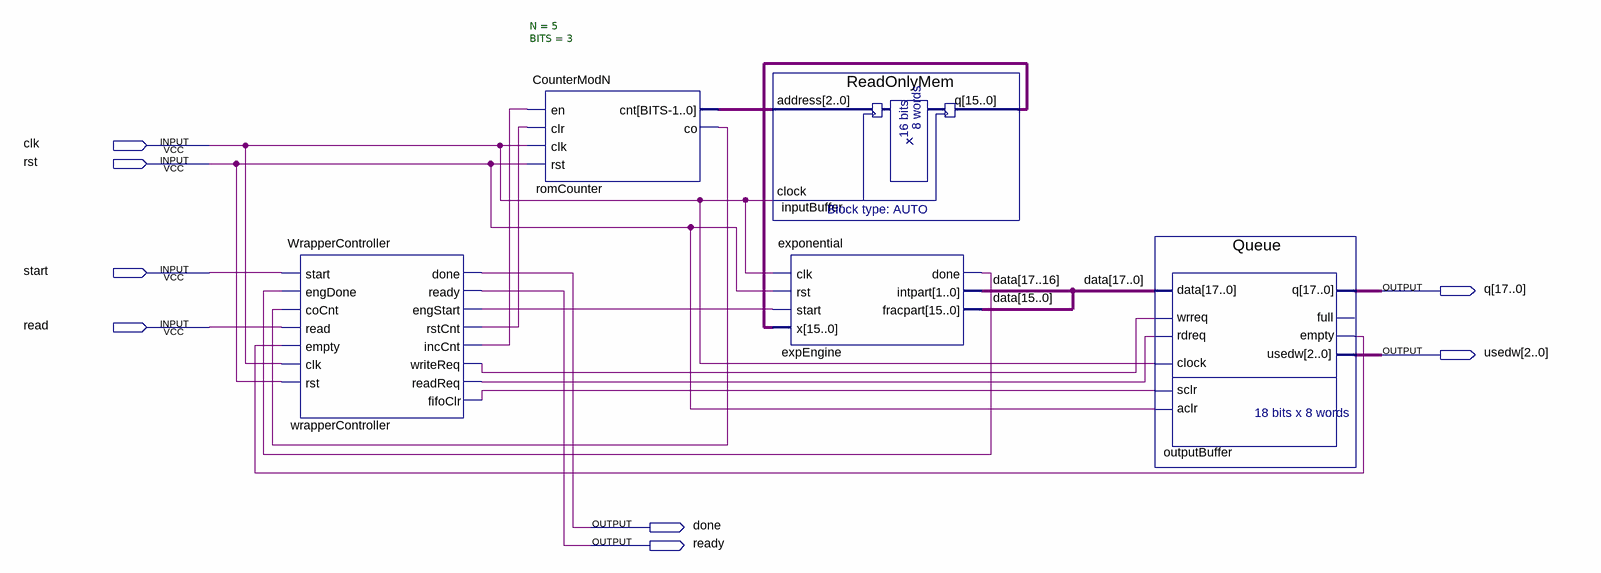
[diagram p0: schematic sheet]
// Quartus schematic ExpAcc.bdf as structural Verilog: 5 symbols, 8 pins
module ExpAcc (
  input  clk,
  input  rst,
  input  start,
  input  read,
  output [17:0] q,
  output [2:0] usedw,
  output done,
  output ready
);

  wire expEngine_done, outputBuffer_empty, romCounter_co, wrapperController_engstart,
       wrapperController_fifoclr, wrapperController_inccnt, wrapperController_readreq,
       wrapperController_rstcnt, wrapperController_writereq;
  wire [2:0] romCounter_cnt;
  wire [15:0] inputBuffer_q;
  wire [17:0] data;

  WrapperController wrapperController (
    .start(start), .engDone(expEngine_done), .coCnt(romCounter_co), .read(read), .empty(outputBuffer_empty),
    .clk(clk), .rst(rst), .done(done), .ready(ready), .engStart(wrapperController_engstart),
    .rstCnt(wrapperController_rstcnt), .incCnt(wrapperController_inccnt),
    .writeReq(wrapperController_writereq), .readReq(wrapperController_readreq),
    .fifoClr(wrapperController_fifoclr));
  CounterModN #(.N(5), .BITS(3)) romCounter (
    .en(wrapperController_inccnt), .clr(wrapperController_rstcnt), .clk(clk), .rst(rst),
    .cnt(romCounter_cnt), .co(romCounter_co));
  ReadOnlyMem inputBuffer (.address(romCounter_cnt), .clock(clk), .q(inputBuffer_q));
  exponential expEngine (
    .clk(clk), .rst(rst), .start(wrapperController_engstart), .x(inputBuffer_q), .done(expEngine_done),
    .intpart(data[17:16]), .fracpart(data[15:0]));
  Queue outputBuffer (
    .data(data), .wrreq(wrapperController_writereq), .rdreq(wrapperController_readreq), .clock(clk),
    .sclr(wrapperController_fifoclr), .aclr(rst), .q(q), .empty(outputBuffer_empty), .usedw(usedw));  // open: full
endmodule
